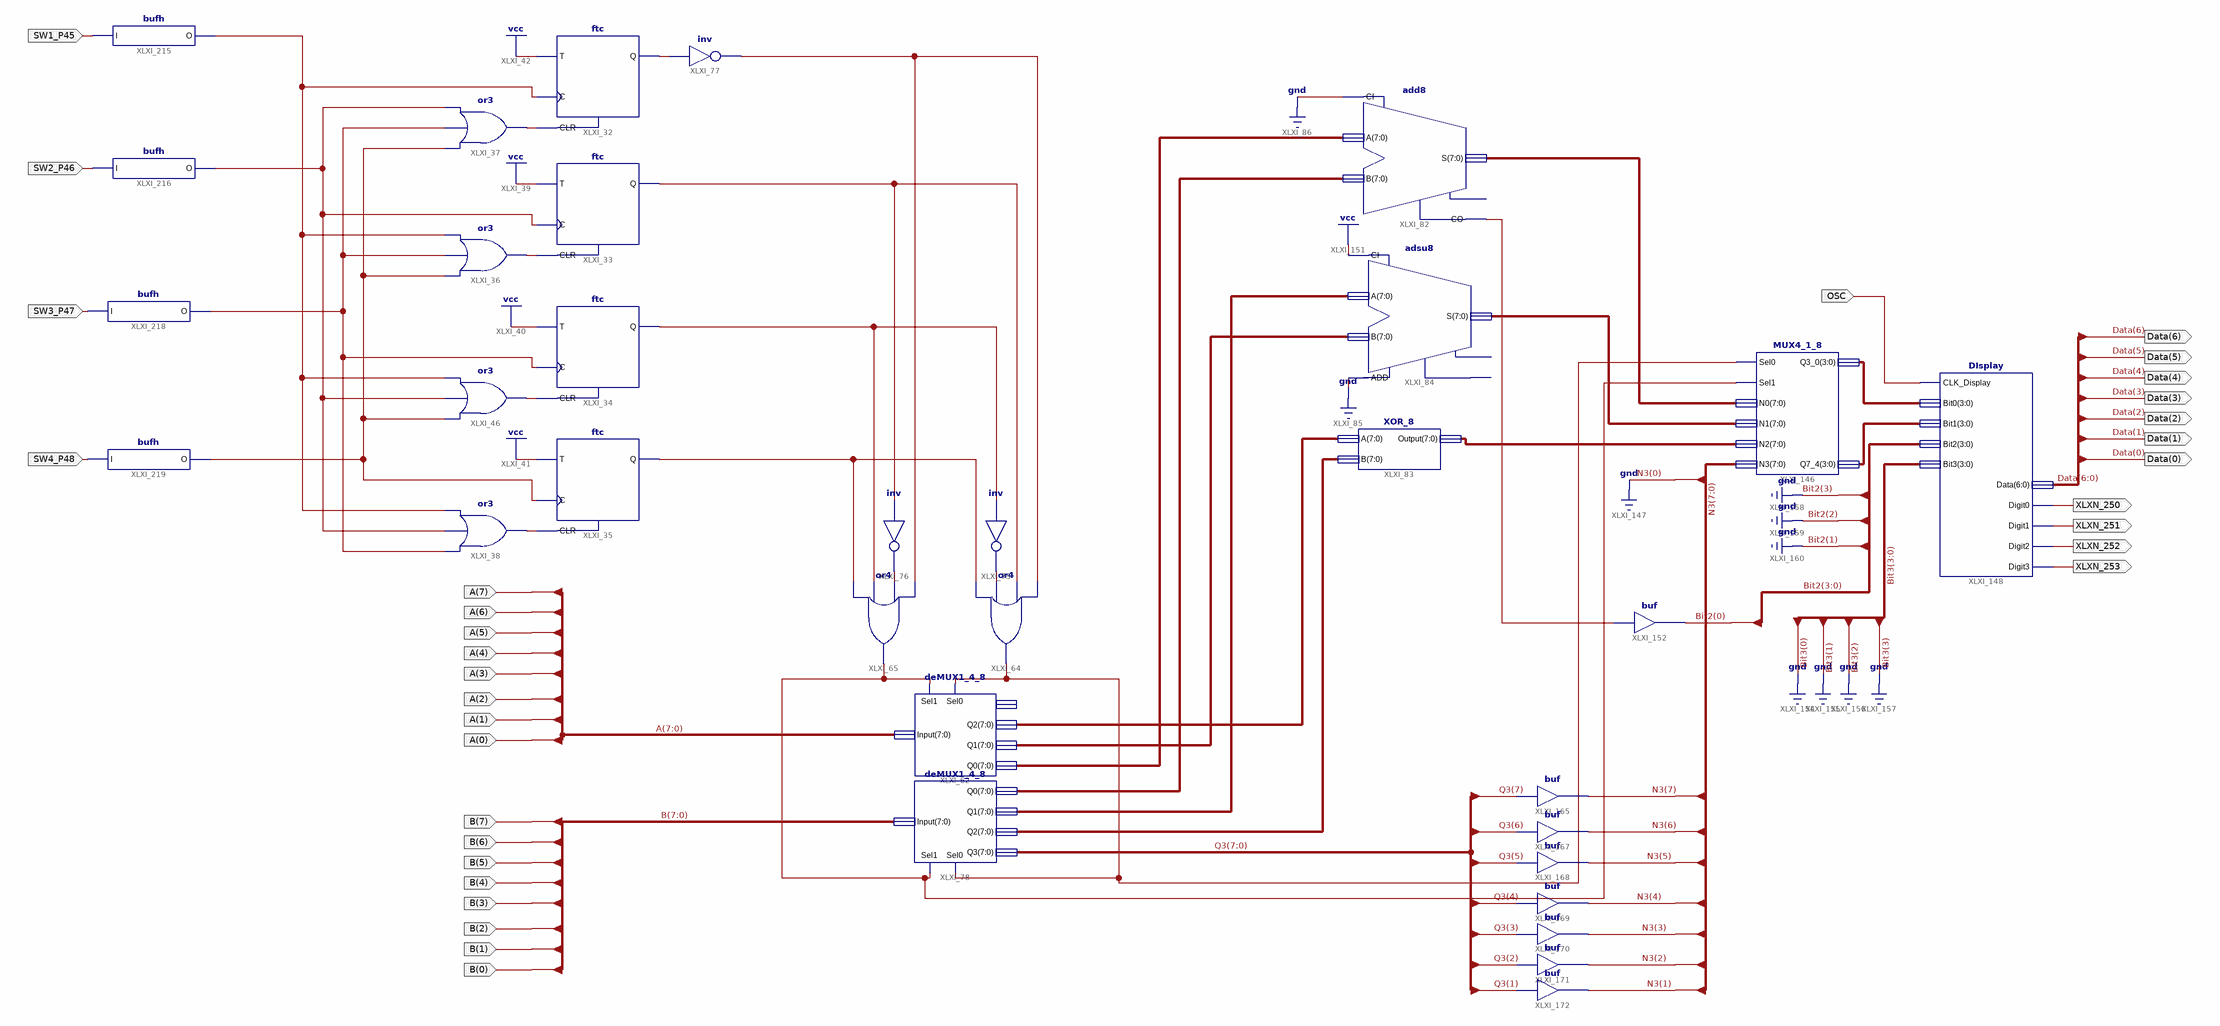
[diagram p0: schematic sheet 1]
// Xilinx ISE schematic Lab09.sch (spartan6) as structural Verilog: 32 symbols, 32 ports
module Lab09 (
  input  [7:0] A,
  input  [7:0] B,
  input  OSC,
  input  SW2_P46,
  input  SW3_P47,
  input  SW4_P48,
  input  SW1_P45,
  output XLXN_250,
  output XLXN_251,
  output XLXN_252,
  output XLXN_253,
  output [6:0] Data
);

  wire XLXN_43, XLXN_44, XLXN_45, XLXN_54, XLXN_106, XLXN_107, XLXN_108, XLXN_113, XLXN_114, XLXN_116,
       XLXN_117, XLXN_119, XLXN_120, XLXN_162, XLXN_352, XLXN_353, XLXN_354, XLXN_355;
  wire [0:0] Bit2;
  wire [3:0] XLXN_232, XLXN_233;
  wire [7:0] Q3, XLXN_149, XLXN_150, XLXN_152, XLXN_153, XLXN_221, XLXN_222, XLXN_224, XLXN_292, XLXN_293;
  wire [7:1] N3;

  or XLXI_36 (XLXN_43, XLXN_353, XLXN_352, XLXN_355);
  ftc XLXI_34 (.C(XLXN_352), .CLR(XLXN_54), .T(1'b1), .Q(XLXN_114));
  ftc XLXI_35 (.C(XLXN_353), .CLR(XLXN_45), .T(1'b1), .Q(XLXN_108));
  or XLXI_38 (XLXN_45, XLXN_352, XLXN_354, XLXN_355);
  ftc XLXI_32 (.C(XLXN_355), .CLR(XLXN_44), .T(1'b1), .Q(XLXN_116));
  or XLXI_37 (XLXN_44, XLXN_353, XLXN_352, XLXN_354);
  or XLXI_46 (XLXN_54, XLXN_353, XLXN_354, XLXN_355);
  ftc XLXI_33 (.C(XLXN_354), .CLR(XLXN_43), .T(1'b1), .Q(XLXN_113));
  deMUX1_4_8 XLXI_62 (
    .Q0(XLXN_149), .Sel0(XLXN_120), .Sel1(XLXN_119), .Input(A), .Q2(XLXN_152), .Q1(XLXN_292));  // open: Q3
  or XLXI_65 (XLXN_119, XLXN_108, XLXN_114, XLXN_107, XLXN_117);
  or XLXI_64 (XLXN_120, XLXN_108, XLXN_106, XLXN_113, XLXN_117);
  not XLXI_75 (XLXN_106, XLXN_114);
  not XLXI_76 (XLXN_107, XLXN_113);
  not XLXI_77 (XLXN_117, XLXN_116);
  deMUX1_4_8 XLXI_78 (
    .Q0(XLXN_150), .Q3(Q3), .Sel0(XLXN_120), .Sel1(XLXN_119), .Input(B), .Q2(XLXN_153), .Q1(XLXN_293));
  add8 XLXI_82 (.A(XLXN_149), .B(XLXN_150), .CI(1'b0), .CO(XLXN_162), .S(XLXN_221));  // open: OFL
  adsu8 XLXI_84 (.A(XLXN_293), .ADD(1'b0), .B(XLXN_292), .CI(1'b1), .S(XLXN_222));  // open: CO, OFL
  XOR_8 XLXI_83 (.A(XLXN_152), .B(XLXN_153), .Output(XLXN_224));
  MUX4_1_8 XLXI_146 (
    .Sel0(XLXN_120), .Sel1(XLXN_119), .N0(XLXN_221), .N1(XLXN_222), .N2(XLXN_224), .N3({N3, 1'b0}),
    .Q3_0(XLXN_232), .Q7_4(XLXN_233));
  DIsplay XLXI_148 (
    .CLK_Display(OSC), .Data(Data), .Digit0(XLXN_250), .Digit1(XLXN_251), .Digit2(XLXN_252),
    .Digit3(XLXN_253), .Bit0(XLXN_232), .Bit3(4'b0000), .Bit2({3'b000, Bit2[0]}), .Bit1(XLXN_233));
  buf XLXI_152 (Bit2[0], XLXN_162);
  buf XLXI_165 (N3[7], Q3[7]);
  buf XLXI_167 (N3[6], Q3[6]);
  buf XLXI_168 (N3[5], Q3[5]);
  buf XLXI_169 (N3[4], Q3[4]);
  buf XLXI_170 (N3[3], Q3[3]);
  buf XLXI_171 (N3[2], Q3[2]);
  buf XLXI_172 (N3[1], Q3[1]);
  bufh XLXI_215 (.I(SW1_P45), .O(XLXN_355));
  bufh XLXI_216 (.I(SW2_P46), .O(XLXN_354));
  bufh XLXI_218 (.I(SW3_P47), .O(XLXN_352));
  bufh XLXI_219 (.I(SW4_P48), .O(XLXN_353));
endmodule
